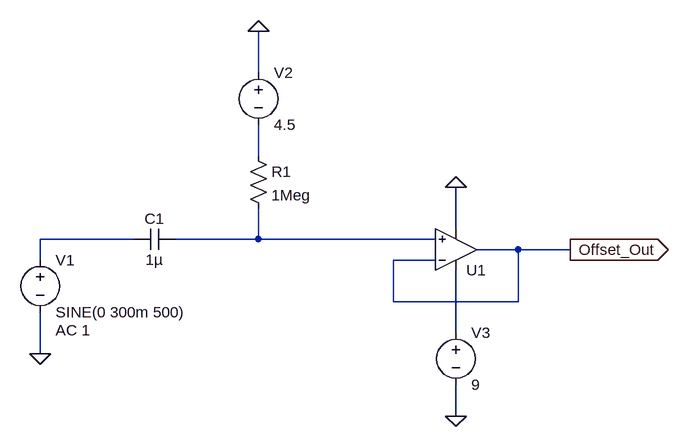
[diagram p0: schematic Offset_Draft.asc]
Offset_Draft.asc, the LTspice schematic file:
Version 4.1
SHEET 1 988 680
WIRE 320 -192 320 -256
WIRE 320 -64 320 -112
WIRE 624 48 624 -16
WIRE 128 64 -16 64
WIRE 320 64 320 16
WIRE 320 64 192 64
WIRE 592 64 320 64
WIRE 720 80 656 80
WIRE 800 80 720 80
WIRE -16 96 -16 64
WIRE 592 96 528 96
WIRE 528 160 528 96
WIRE 720 160 720 80
WIRE 720 160 528 160
WIRE 624 208 624 112
WIRE -16 240 -16 176
WIRE 624 336 624 288
FLAG -16 240 0
FLAG 624 336 0
FLAG 320 -256 0
FLAG 624 -16 0
FLAG 800 80 Offset_Out
IOPIN 800 80 Out
SYMBOL voltage -16 80 R0
WINDOW 123 24 124 Left 2
WINDOW 39 0 0 Left 0
SYMATTR InstName V1
SYMATTR Value SINE(0 300m 500)
SYMATTR Value2 AC 1
SYMBOL voltage 320 -208 R0
WINDOW 123 0 0 Left 0
WINDOW 39 0 0 Left 0
SYMATTR InstName V2
SYMATTR Value 4.5
SYMBOL voltage 624 192 R0
WINDOW 123 0 0 Left 0
WINDOW 39 0 0 Left 0
SYMATTR InstName V3
SYMATTR Value 9
SYMBOL cap 192 48 R90
WINDOW 0 0 32 VBottom 2
WINDOW 3 32 32 VTop 2
SYMATTR InstName C1
SYMATTR Value 1µ
SYMBOL res 304 -80 R0
SYMATTR InstName R1
SYMATTR Value 1Meg
SYMBOL OpAmps\\UniversalOpAmp 624 80 M180
SYMATTR InstName U1

The netlist it stands for:
* Offset_Draft.asc
V1 N002 0 SINE(0 300m 500) AC 1
V2 0 N001 4.5
V3 N004 0 9
C1 N003 N002 1µ
R1 N001 N003 1Meg
X§U1 N003 Offset_Out N004 0 Offset_Out level1 Avol=1Meg GBW=10Meg Vos=0 En=0 Enk=0 In=0 Ink=0 Rin=500Meg  ; pins In+ In- V+ V- OUT
.lib UniversalOpAmp1.lib
.backanno
.end